# Altium schematic sheet Diode - Led.SchDoc
size A3; SheetNumber: 27; SheetTotal: 41
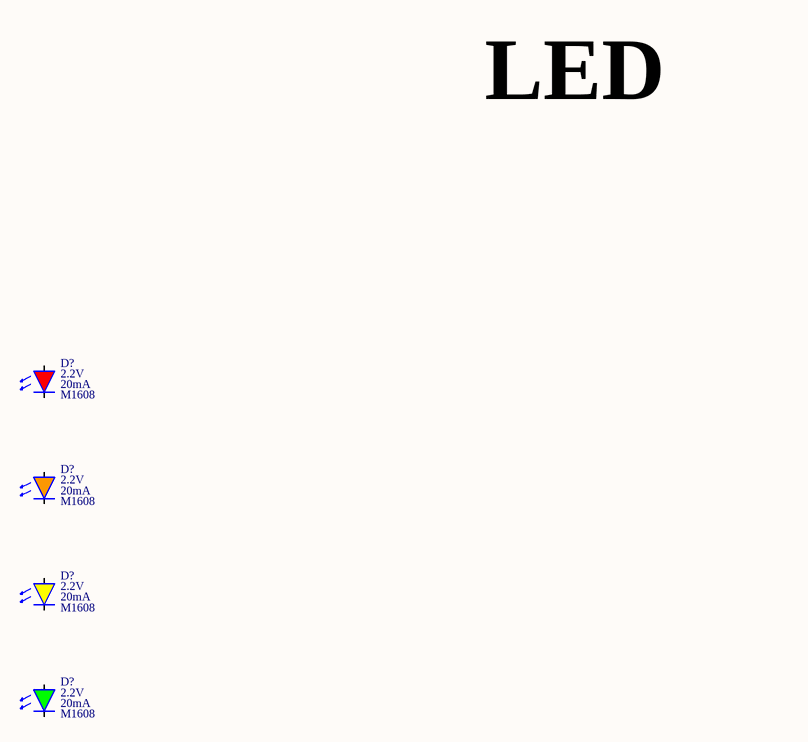
[diagram p0: Diode - Led.SchDoc]

## Parts
(Parts that share a designator on the sheet are numbered #1, #2 ... from top to bottom, then left to right.)
D?#1  Current: 20mA  Voltage: 2.2V  Package: M1608  [Diode_Smd_M1608_I0603_Red]  (hidden comment: Diode_Led)
D?#2  Current: 20mA  Voltage: 2.2V  Package: M1608  [Diode_Smd_M1608_I0603_Orange1]  (hidden comment: Diode_Led)
D?#3  Current: 20mA  Voltage: 2.2V  Package: M1608  [Diode_Smd_M1608_I0603_Yellow]  (hidden comment: Diode_Led)
D?#4  Current: 20mA  Voltage: 2.2V  Package: M1608  [Diode_Smd_M1608_I0603_Green-Yellow]  (hidden comment: Diode_Led)

## Nets

Not connected (* = marked no-connect by the designer): D?#1 A C; D?#2 A C; D?#3 A C; D?#4 A C

## Notes on the sheet
- LED

## Library data of the parts
D?#1 = Diode_Led: Diode, Led, Red, 2.2V, 20mA, M1608; Manufacturer Part Number: SML-D12U1WT86; Manufacturer: Rohm; ComponentLink1Description: Datasheet; ComponentLink1URL: E:\Altium\Datasheets\Diode\Rohm, SML-D12x1 Series.pdf; ComponentLink2Description: Supplier Link; ComponentLink2URL: https://www.digikey.com/en/products/detail/rohm-semiconductor/SML-D12U1WT86/5843853; Supplier: Digikey; Supplier Part Number: SML-D12U1WT86CT-ND; Operating Temperature, Min: -40℃; Operating Temperature, Max: +85℃; Quantity, Min: 1; Quantity, Max: 75000; Price, Min: 0.25; Price, Max: 0.02838; Supplier Currency: $; Supplier Link: https://www.digikey.com/en/products/detail/rohm-semiconductor/SML-D12U1WT86/5843853; Component Type: Led; Component Category: Diode
D?#2 = Diode_Led: Diode, Led, Orange, 2.2V, 20mA, M1608; Manufacturer Part Number: SML-D12D1WT86; Manufacturer: Rohm; ComponentLink1Description: Datasheet; ComponentLink1URL: E:\Altium\Datasheets\Diode\Rohm, SML-D12x1 Series.pdf; ComponentLink2Description: Supplier Link; ComponentLink2URL: https://www.digikey.com/en/products/detail/rohm-semiconductor/SML-D12D1WT86/5843854; Supplier: Digikey; Supplier Part Number: SML-D12D1WT86CT-ND; Operating Temperature, Min: -40℃; Operating Temperature, Max: +85℃; Quantity, Min: 1; Quantity, Max: 75000; Price, Min: 0.25; Price, Max: 0.02838; Supplier Currency: $; Supplier Link: https://www.digikey.com/en/products/detail/rohm-semiconductor/SML-D12D1WT86/5843854; Component Type: Led; Component Category: Diode
D?#3 = Diode_Led: Diode, Led, Yellow, 2.2V, 20mA, M1608; Manufacturer Part Number: SML-D12Y1WT86; Manufacturer: Rohm; ComponentLink1Description: Datasheet; ComponentLink1URL: E:\Altium\Datasheets\Diode\Rohm, SML-D12x1 Series.pdf; ComponentLink2Description: Supplier Link; ComponentLink2URL: https://www.digikey.com/en/products/detail/rohm-semiconductor/SML-D12Y1WT86/5843855; Supplier: Digikey; Supplier Part Number: SML-D12Y1WT86CT-ND; Operating Temperature, Min: -40℃; Operating Temperature, Max: +85℃; Quantity, Min: 1; Quantity, Max: 75000; Price, Min: 0.25; Price, Max: 0.02838; Supplier Currency: $; Supplier Link: https://www.digikey.com/en/products/detail/rohm-semiconductor/SML-D12Y1WT86/5843855; Component Type: Led; Component Category: Diode
D?#4 = Diode_Led: Diode, Led, Green-Yellow, 2.2V, 20mA, M1608; Manufacturer Part Number: SML-D12M1WT86; Manufacturer: Rohm; ComponentLink1Description: Datasheet; ComponentLink1URL: E:\Altium\Datasheets\Diode\Rohm, SML-D12x1 Series.pdf; ComponentLink2Description: Supplier Link; ComponentLink2URL: https://www.digikey.com/en/products/detail/rohm-semiconductor/SML-D12M1WT86/5843856; Supplier: Digikey; Supplier Part Number: SML-D12M1WT86CT-ND; Operating Temperature, Min: -40℃; Operating Temperature, Max: +85℃; Quantity, Min: 1; Quantity, Max: 75000; Price, Min: 0.25; Price, Max: 0.02838; Supplier Currency: $; Supplier Link: https://www.digikey.com/en/products/detail/rohm-semiconductor/SML-D12M1WT86/5843856; Component Type: Led; Component Category: Diode